# Altium schematic sheet Offset_7pt5.SchDoc
size A4; SheetNumber: 3; SheetTotal: 3
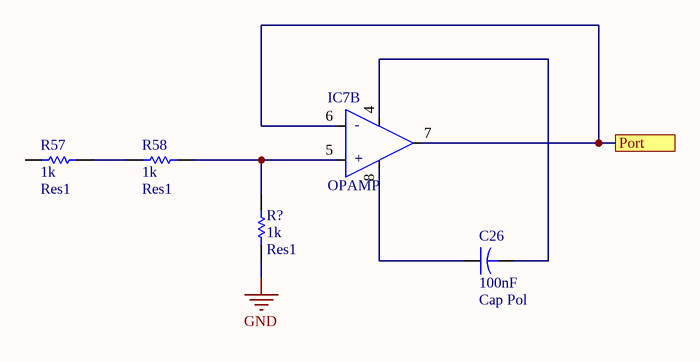
[diagram p0: Offset_7pt5.SchDoc]

## Parts
C26  Cap Pol  value 100nF  [CAPR5-4X5]
IC7  OPAMP  [DIP-8]  (part B of 2)
R57  Res1  value 1k  [AXIAL-0.3]
R58  Res1  value 1k  [AXIAL-0.3]
R?  Res1  value 1k  [AXIAL-0.3]

## Ports
Port

## Nets
GND: R?.1
Port: IC7.6(IN_B_-) IC7.7(OUT_B) ; port Port
NetC26_1: C26.1 IC7.8(V+)
NetC26_2: C26.2 IC7.4(-V)
NetIC7_5: IC7.5(IN_B_+) R58.2 R?.2
NetR57_2: R57.2 R58.1

Not connected (* = marked no-connect by the designer): R57 1

## Notes on the sheet
- (in symbol ADTL082, part B) -; +

## Library data of the parts
C26 = Cap Pol: Capacitor; Published: 23-Sep-2002; PackageReference: CAPR5-4X5; Publisher: Altium Limited; PackageDescription: Capacitor; 2 Leads
IC7 = ADTL082
R57 R58 R? = Res1: Resistor; Published: 8-Jun-2000; LatestRevisionDate: 17-Jul-2002; LatestRevisionNote: Re-released for DXP Platform.; PackageReference: AXIAL-0.3; Publisher: Altium Limited; PackageDescription: Axial Device, Thru-Hole; 2 Leads; 0.3 in Pin Spacing